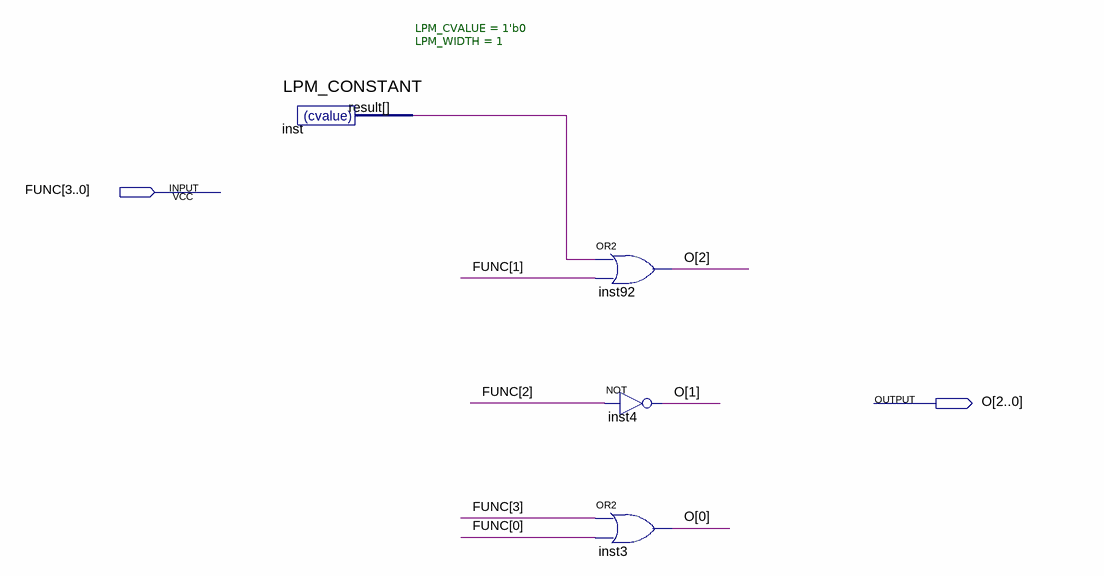
[diagram p0: schematic sheet]
// Quartus schematic ALUdec.bdf as structural Verilog: 4 symbols, 2 pins
module ALUdec (
  input  [3:0] FUNC,
  output [2:0] O
);

  wire inst_result;

  LPM_CONSTANT #(.LPM_CVALUE(1'b0), .LPM_WIDTH(1)) inst (.result(inst_result));
  or inst92 (O[2], inst_result, FUNC[1]);
  not inst4 (O[1], FUNC[2]);
  or inst3 (O[0], FUNC[3], FUNC[0]);
endmodule
